# Altium schematic sheet CONNECTROS.SchDoc
size A
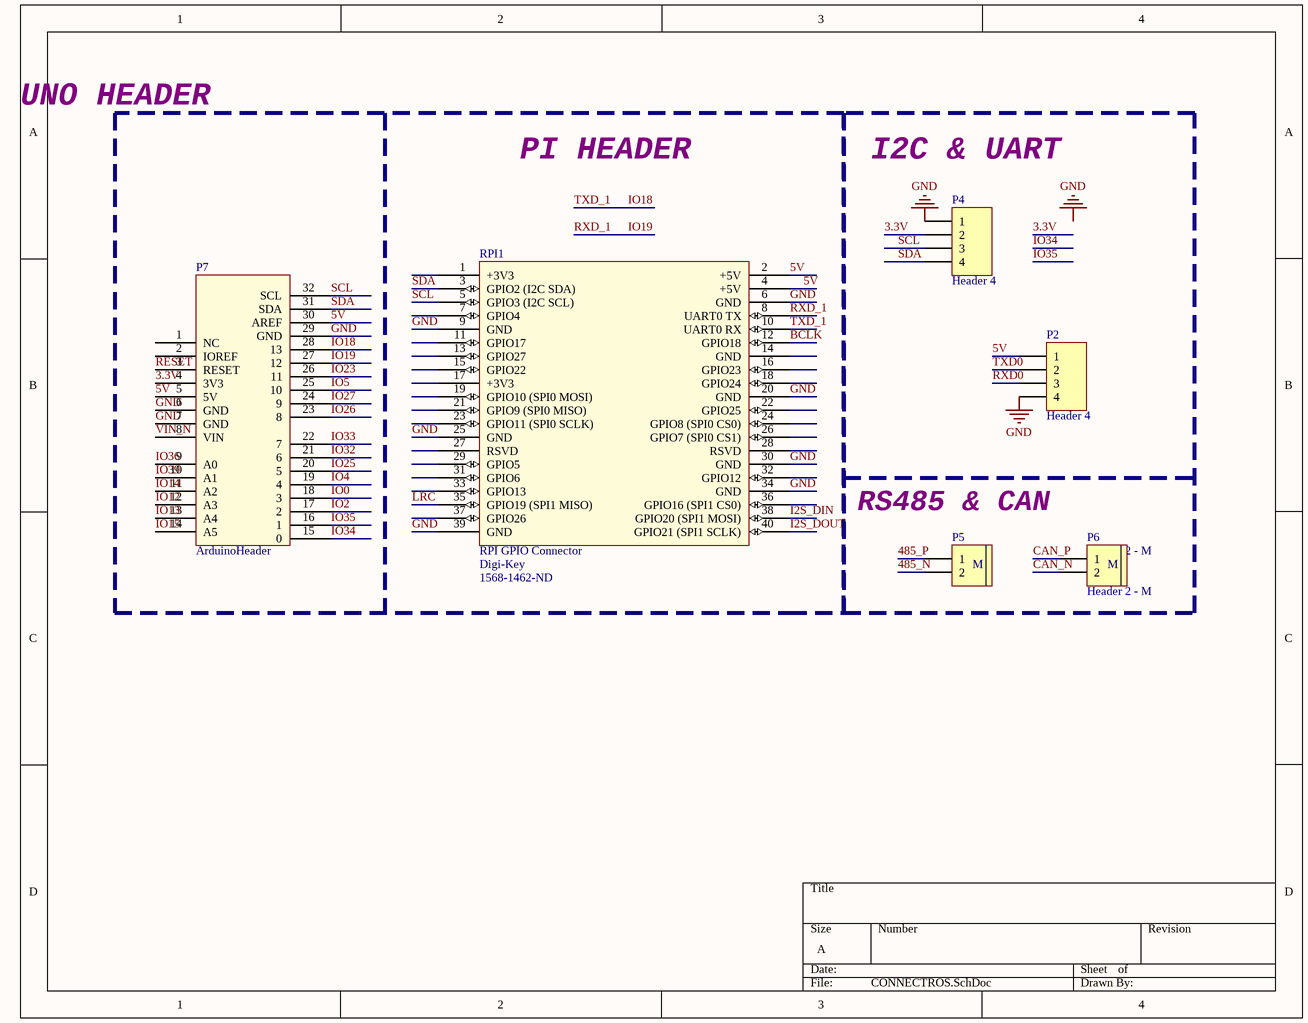
[diagram p0: CONNECTROS.SchDoc]

## Parts
P2  Header 4  [HDR1X4]
P4  Header 4  [CONN-TH_XH2.54-4AW]
P5  Header 2 - M  [Medium - Header 2]
P6  Header 2 - M  [Medium - Header 2]
P7  ArduinoHeader  [ArduinoClone2]
RPI1  RPI GPIO Connector  Supplier 1: Digi-Key  Supplier Part Number 1: 1568-1462-ND  [rpi]

## Blocks framed on the sheet
I2C & UART: P2 P4-P6

## Nets
GND: P2.4 P4.1 P7.6(GND) P7.7(GND) P7.29(GND) RPI1.6(GND) RPI1.9(GND) RPI1.20(GND) RPI1.25(GND) RPI1.30(GND) RPI1.34(GND) RPI1.39(GND)
3.3V: P4.2 P7.4(3V3)
5V: P2.1 P7.5(5V) P7.30(AREF) RPI1.2(+5V) RPI1.4(+5V)
485_N: P5.2
485_P: P5.1
BCLK: RPI1.12(GPIO18)
CAN_N: P6.2
CAN_P: P6.1
I2S_DIN: RPI1.38(GPIO20_(SPI1_MOSI))
I2S_DOUT: RPI1.40(GPIO21_(SPI1_SCLK))
IO0: P7.18(3)
IO2: P7.17(2)
IO4: P7.19(4)
IO5: P7.25(10)
IO12: P7.12(A3)
IO13: P7.13(A4)
IO14: P7.11(A2)
IO15: P7.14(A5)
IO18: P7.28(13) RPI1.10(UART0_RX)  [also labelled TXD_1]
IO19: P7.27(12) RPI1.8(UART0_TX)  [also labelled RXD_1]
IO23: P7.26(11)
IO25: P7.20(5)
IO26: P7.23(8)
IO27: P7.24(9)
IO32: P7.21(6)
IO33: P7.22(7)
IO34: P7.15(0)
IO35: P7.16(1)
IO36: P7.9(A0)
IO39: P7.10(A1)
LRC: RPI1.35(GPIO19_(SPI1_MISO))
RESET: P7.3(RESET)
RXD0: P2.3
SCL: P4.3 P7.32(SCL) RPI1.5(GPIO3_(I2C_SCL))
SDA: P4.4 P7.31(SDA) RPI1.3(GPIO2_(I2C_SDA))
TXD0: P2.2
VIN_N: P7.8(VIN)

Not connected (* = marked no-connect by the designer): P7 1(NC) 2(IOREF); RPI1 1(+3V3) 7(GPIO4) 11(GPIO17) 13(GPIO27) 14(GND) 15(GPIO22) 16(GPIO23) 17(+3V3) 18(GPIO24) 19(GPIO10_(SPI0_MOSI)) 21(GPIO9_(SPI0_MISO)) 22(GPIO25) 23(GPIO11_(SPI0_SCLK)) 24(GPIO8_(SPI0_CS0)) 26(GPIO7_(SPI0_CS1)) 27(RSVD) 28(RSVD) 29(GPIO5) 31(GPIO6) 32(GPIO12) 33(GPIO13) 36(GPIO16_(SPI1_CS0)) 37(GPIO26)

## Notes on the sheet
- UNO HEADER
- PI HEADER
- (near P5) RS485 & CAN
- Labels drawn without touching a wire or pin: GND
- (in symbol Header 2 - M) M

## Library data of the parts
P2 P4 = Header 4: Header, 4-Pin; LatestRevisionDate: 17-Jul-2002; LatestRevisionNote: Re-released for DXP Platform.; Publisher: Altium Limited
P5 P6 = Header 2 - M: Header, 2-Pin, Medium; LatestRevisionDate: 17-Jul-2002; LatestRevisionNote: Re-released for DXP Platform.; Publisher: Altium Limited
RPI1 = rpi connector: GPIO Header for Raspberry Pi A+/B+/Pi 2/Pi 3 - 2x20; Manufacturer: SparkFun Electronics; Manufacturer Part Number: PRT-14017; Nils Minor: author; nilsminor@web.de: mail; RoHS: RoHS Compliant; Category: Development Boards, Kits, Programmers; Stock 1: 150; Pricing 1: 1=1.84 (EUR); Part Status: Active; Accessory Type: Connector; For Use With/Related Products: Raspberry Pi; ComponentLink1URL: https://cdn.sparkfun.com/datasheets/Dev/RaspberryPi/12313.pdf; ComponentLink1Description: https://cdn.sparkfun.com/datasheets/Dev/RaspberryPi/12313.pdf